# EAGLE design MD2_SE Main rev4_1 (EAGLE 9.1.3)
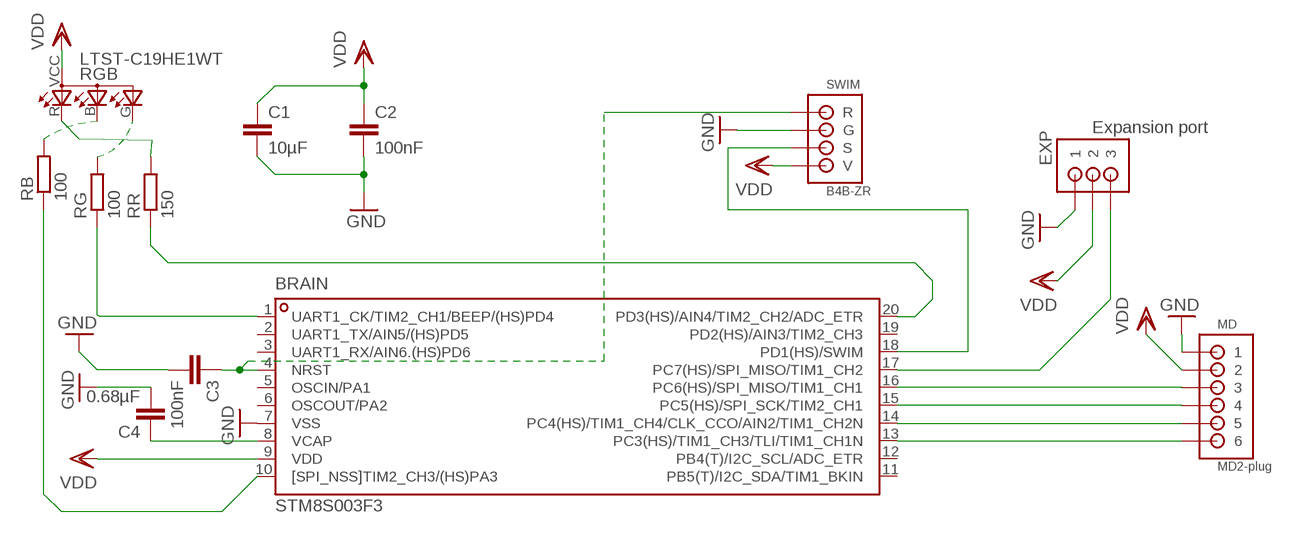
[diagram p0: schematic, sheet 1]

## Parts
BRAIN  STM8S003F3  [TSSOP20]
C1  10µF  C-EUC0603K  [C0603K]
C2  100nF  C-EUC0603K  [C0603K]
C3  100nF  C-EUC0603K  [C0603K]
C4  0.68µF  C-EUC0603K  [C0603K]
EXP  Expansion port  B3B-ZR  [B3B-ZR]
MD  MD2-plug  B6B-ZR  [B6B-ZR]
RB  100  R-EU_R0603  [R0603]
RG  100  R-EU_R0603  [R0603]
RGB  LTST-C19HE1WT  [0606]
RR  150  R-EU_R0603  [R0603]
SWIM  B4B-ZR  [B4B-ZR]

## Nets
BLUE$1: BRAIN.10([SPI_NSS]TIM2_CH3/(HS)PA3) RB.1
BLUE$2: RB.2 RGB.B(CBLUE)
EXP$1: BRAIN.17(PC7(HS)/SPI_MISO/TIM1_CH2) EXP.3
GND: BRAIN.7(VSS) C1.2 C2.2 C3.2 C4.2 EXP.1 MD.1 SWIM.GND(G)
GREEN$1: BRAIN.1(UART1_CK/TIM2_CH1/BEEP/(HS)PD4) RG.1
GREEN$2: RG.2 RGB.G(CGREEN)
HZ$1: BRAIN.14(PC4(HS)/TIM1_CH4/CLK_CCO/AIN2/TIM1_CH2N) MD.5
LANG$1: BRAIN.13(PC3(HS)/TIM1_CH3/TLI/TIM1_CH1N) MD.6
RED$1: BRAIN.20(PD3(HS)/AIN4/TIM2_CH2/ADC_ETR) RR.1
RED$2: RGB.R(CRED) RR.2
REGION$1: BRAIN.15(PC5(HS)/SPI_SCK/TIM2_CH1) MD.4
RST_BTN$1: BRAIN.16(PC6(HS)/SPI_MISO/TIM1_CH1) MD.3
SWIM$1: BRAIN.18(PD1(HS)/SWIM) SWIM.SWIM(S)
SWM_RST$1: BRAIN.4(NRST) C3.1 SWIM.RST(R)
VCAP$1: BRAIN.8(VCAP) C4.1
VDD: BRAIN.9(VDD) C1.1 C2.1 EXP.2 MD.2 RGB.VCC(V+) SWIM.VDD(V)
Unconnected: BRAIN.2(UART1_TX/AIN5/(HS)PD5) BRAIN.3(UART1_RX/AIN6.(HS)PD6) BRAIN.5(OSCIN/PA1) BRAIN.6(OSCOUT/PA2) BRAIN.11(PB5(T)/I2C_SDA/TIM1_BKIN) BRAIN.12(PB4(T)/I2C_SCL/ADC_ETR) BRAIN.19(PD2(HS)/AIN3/TIM2_CH3)

## Library data of the parts
BRAIN = Mine:STM8S003F3
C1-C4 = rcl:C-EU: CAPACITOR, European symbol; SPICEPREFIX: C
EXP = Mine:B3B-ZR: JST-ZH Connector 3 pol, 1.5mm pitch Package: B3B-ZR Source: http://www.jst-mfg.com/product/pdf/eng/eZH.pdf
MD = Mine:B6B-ZR: JST-ZH Connector 6 pol, 1.5mm pitch Package: B6B-ZR Source: http://www.jst-mfg.com/product/pdf/eng/eZH.pdf
RB RG RR = rcl:R-EU_: RESISTOR, European symbol; SPICEPREFIX: R
RGB = Mine:LTST-C19HE1WT: LITEON DEL standard - CMS LED Red 615nm Grn 525nm/Blu 470nm
SWIM = Mine:B4B-ZR: JST-ZH Connector 4 pol, 1.5mm pitch Package: B4B-ZR Source: http://www.jst-mfg.com/product/pdf/eng/eZH.pdf

## Board
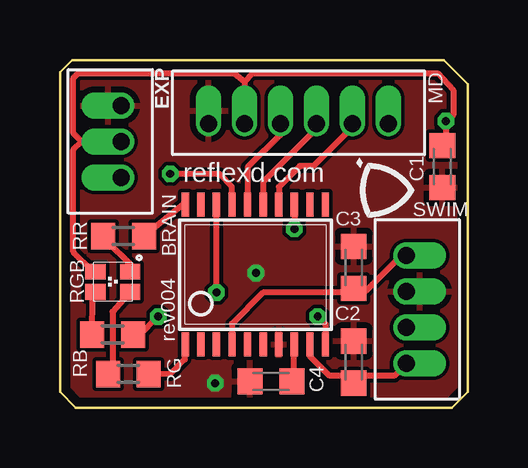
[diagram p1: board, top side]
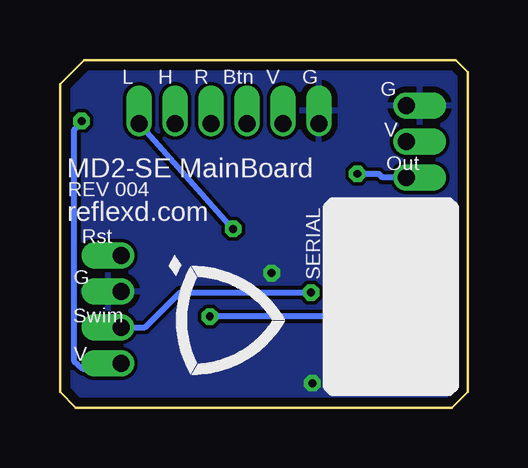
[diagram p2: board, bottom side, seen from below]

Size 17 x 14.5 mm. Coordinates in mm from the lower left corner, seen from the top.
Outline: 0,0.65 0.65,0 16.35,0 17,0.65 17,13.5 16,14.5 0.5,14.5 0,14 0,0.65
Copper layers (1*16): Top 0.0356mm / dielectric 1.5011mm / Bottom 0.0356mm
Design rules "LaenPCBOrder *": minimum track width 6mil, minimum drill 13mil, track to track 6mil, track to pad 6mil, pad to pad 6mil, via to via 6mil, smd to smd 6mil, copper to edge 15mil, drill to drill 6mil, minimum pad ring 7mil, minimum via ring 7mil, stop-mask expansion 3mil, vias tented up to drill 15mil, thermal gap 10mil

### Footprints (pad centres in the part's own frame; a part is rotated, then mirrored left to right if it is on the bottom)
TSSOP20 = smd 0.305 x 0.991: 1 -2.925,-2.918; 2 -2.275,-2.918; 3 -1.625,-2.918; 4 -0.975,-2.918; 5 -0.325,-2.918; 6 0.325,-2.918; 7 0.975,-2.918; 8 1.625,-2.918; 9 2.275,-2.918; 10 2.925,-2.918; 11 2.925,2.918; 12 2.275,2.918; 13 1.625,2.918; 14 0.975,2.918; 15 0.325,2.918; 16 -0.325,2.918; 17 -0.975,2.918; 18 -1.625,2.918; 19 -2.275,2.918; 20 -2.925,2.918
C0603K = smd 1.05 x 1.08: 1 -0.875,0; 2 0.875,0
B3B-ZR = drill 0.7 pad 1.1 offset: 1 -1.5,0; 2 0,0; 3 1.5,0
B6B-ZR = drill 0.7 offset: 1 3.75,0; 2 2.25,0; 3 0.75,0; 4 -0.75,0; 5 -2.25,0; 6 -3.75,0
R0603 = smd 1 x 1.1: 1 -0.85,0; 2 0.85,0
0606 = smd 0.65 x 0.85: B 0.425,-0.725; G 0.425,0.725; R -0.425,0.725; VCC -0.425,-0.725
B4B-ZR = drill 0.7 pad 1.1 offset: GND 0.75,0; RST 2.25,0; SWIM -0.75,0; VDD -2.25,0

### Placement (x,y rotation side)
BRAIN  8.15,5.55 0 top
C1  15.95,10.05 270 top
C2  12.25,1.9 90 top
C3  12.25,5.85 90 top
C4  8.8,1.1 180 top
EXP  2.55,11.1 270 top
MD  9.95,11.85 180 top
RB  2.2,3.05 180 top
RG  2.85,1.4 180 top
RGB  2.2,5.25 270 top
RR  2.65,7.15 180 top
SWIM  14.45,4.1 90 top
U$1  [LOGO-2.5MM]  13.3,9.05 0 top
U$2  [LOGO-5MM-BOTTOM]  11,3.65 0 top

### Tracks (layer width: path | path; a pad name or v marks a point on that pad's centre or on a via)
BLUE$1  (via drill 0.33)
  Top 0.152: 11.08,2.8 BRAIN.10
  Top 0.254: v10.75,3.8 11.08,3.48 11.08,2.8 | v4.1,3.8 3.25,2.95 RB.1
  Bottom 0.254: v4.1,3.8 v10.75,3.8
BLUE$2
  Top 0.254: RB.2 1.36,4.64 RGB.B
EXP$1  (via drill 0.33)
  Top 0.152: 7.18,8.53 7.16,8.5 BRAIN.17
  Top 0.254: 7.18,8.53 7.18,9.2 6.65,9.75 4.75,9.75 v4.6,9.75
  Bottom 0.254: v4.6,9.75 3.7,9.75 3.55,9.6 EXP.3
GND  (via drill 0.33)
  Top 0.152: 9.11,2.52 9.11,2.65 BRAIN.7 9.11,2.71 9.11,3.04
  Top 0.254: 9.11,2.26 9.11,2.52
  other vias: 6.48,1.01 8.18,5.61
  pour Bottom (isolate 0.125): 0.5,14.5 0,14 0,0.65 0.65,0 16.35,0 17,0.65 17,13.5 16,14.5
  pour Top (isolate 0.125): 0,14 0.5,14.5 16,14.5 17,13.5 17,0.65 16.35,0 9.65,0 9.4,0.25 9.4,2.15 8.2,2.15 8.2,0 0.65,0 0,0.65
GREEN$1
  Top 0.254: BRAIN.1 5.21,2.01 4.59,1.39 RG.1
GREEN$2
  Top 0.254: RG.2 2.19,1.56 2.19,3.99 RGB.G
HZ$1
  Top 0.152: 9.11,8.4 BRAIN.14 9.12,8.62
  Top 0.254: 9.12,8.62 9.12,9.2 10,10.07 10.58,10.07 12.08,11.57 MD.5
LANG$1  (via drill 0.33)
  Top 0.152: 9.76,8.5 BRAIN.13
  Top 0.254: BRAIN.13 v9.78,7.46 v9.78,7.45
  Bottom 0.254: v9.78,7.45 9.8,7.45 MD.6
RED$1
  Top 0.254: BRAIN.20 5.15,8.5 RR.1
RED$2
  Top 0.254: RR.2 1.9,7 3,5.9 RGB.R
REGION$1
  Top 0.152: 8.47,8.53 BRAIN.15
  Top 0.254: 8.47,8.53 8.47,9.4 10.68,11.62 MD.4
RST_BTN$1
  Top 0.152: BRAIN.16
  Top 0.254: BRAIN.16 7.83,10.03 9.28,11.47 MD.3
SWIM$1  (via drill 0.33)
  Top 0.152: 6.53,8.4 BRAIN.18
  Top 0.254: v6.53,4.8 6.53,8.4
  Bottom 0.254: SWIM.SWIM 13.45,3.35 12,4.8 v6.53,4.8
SWM_RST$1
  Top 0.152: 7.18,3 BRAIN.4
  Top 0.254: 7.18,3 7.18,3.5 8.47,4.8 12.05,4.8 C3.1 12.77,4.87 13.97,6.08 14.18,6.08 SWIM.RST
VCAP$1
  Top 0.152: 9.76,2.65 BRAIN.8 | 9.76,1.02 10.1,0.86 C4.1
  Top 0.254: 9.76,1.02 9.76,2.65
VDD  (via drill 0.33)
  Top 0.152: 10.41,2.55 BRAIN.9
  Top 0.254: 10.41,2.62 10.41,2.55 10.41,2.16 11.25,1.33 12.09,1.33 C2.1 12.45,1.33 13.94,1.33 SWIM.VDD | 7.7,13.6 MD.2 | 7.7,13.6 8.04,13.94 15.75,13.94 16.4,13.25 16.4,12.2 v16.1,11.95 16.1,11.29 C1.1 | 0.9,11.1 0.56,10.76 0.56,6.5 1.39,5.67 RGB.VCC | 0.9,11.1 EXP.2 0.9,11.1 | 0.9,11.1 0.56,11.44 0.56,13.74 0.76,13.94 7.26,13.94 7.7,13.6
  Bottom 0.254: v16.1,11.95 16.4,11.6 16.4,1.93 16.05,1.62 14.39,1.62 SWIM.VDD

### Text on the board
tNames: reflexd.com | rev004
bNames: G | V | Btn | R | H | L | G | V | Out | MD2-SE MainBoard | REV 004 | reflexd.com | Rst | SERIAL | G | Swim | V